# EAGLE design Astable 555 Timer (EAGLE 9.6.2)
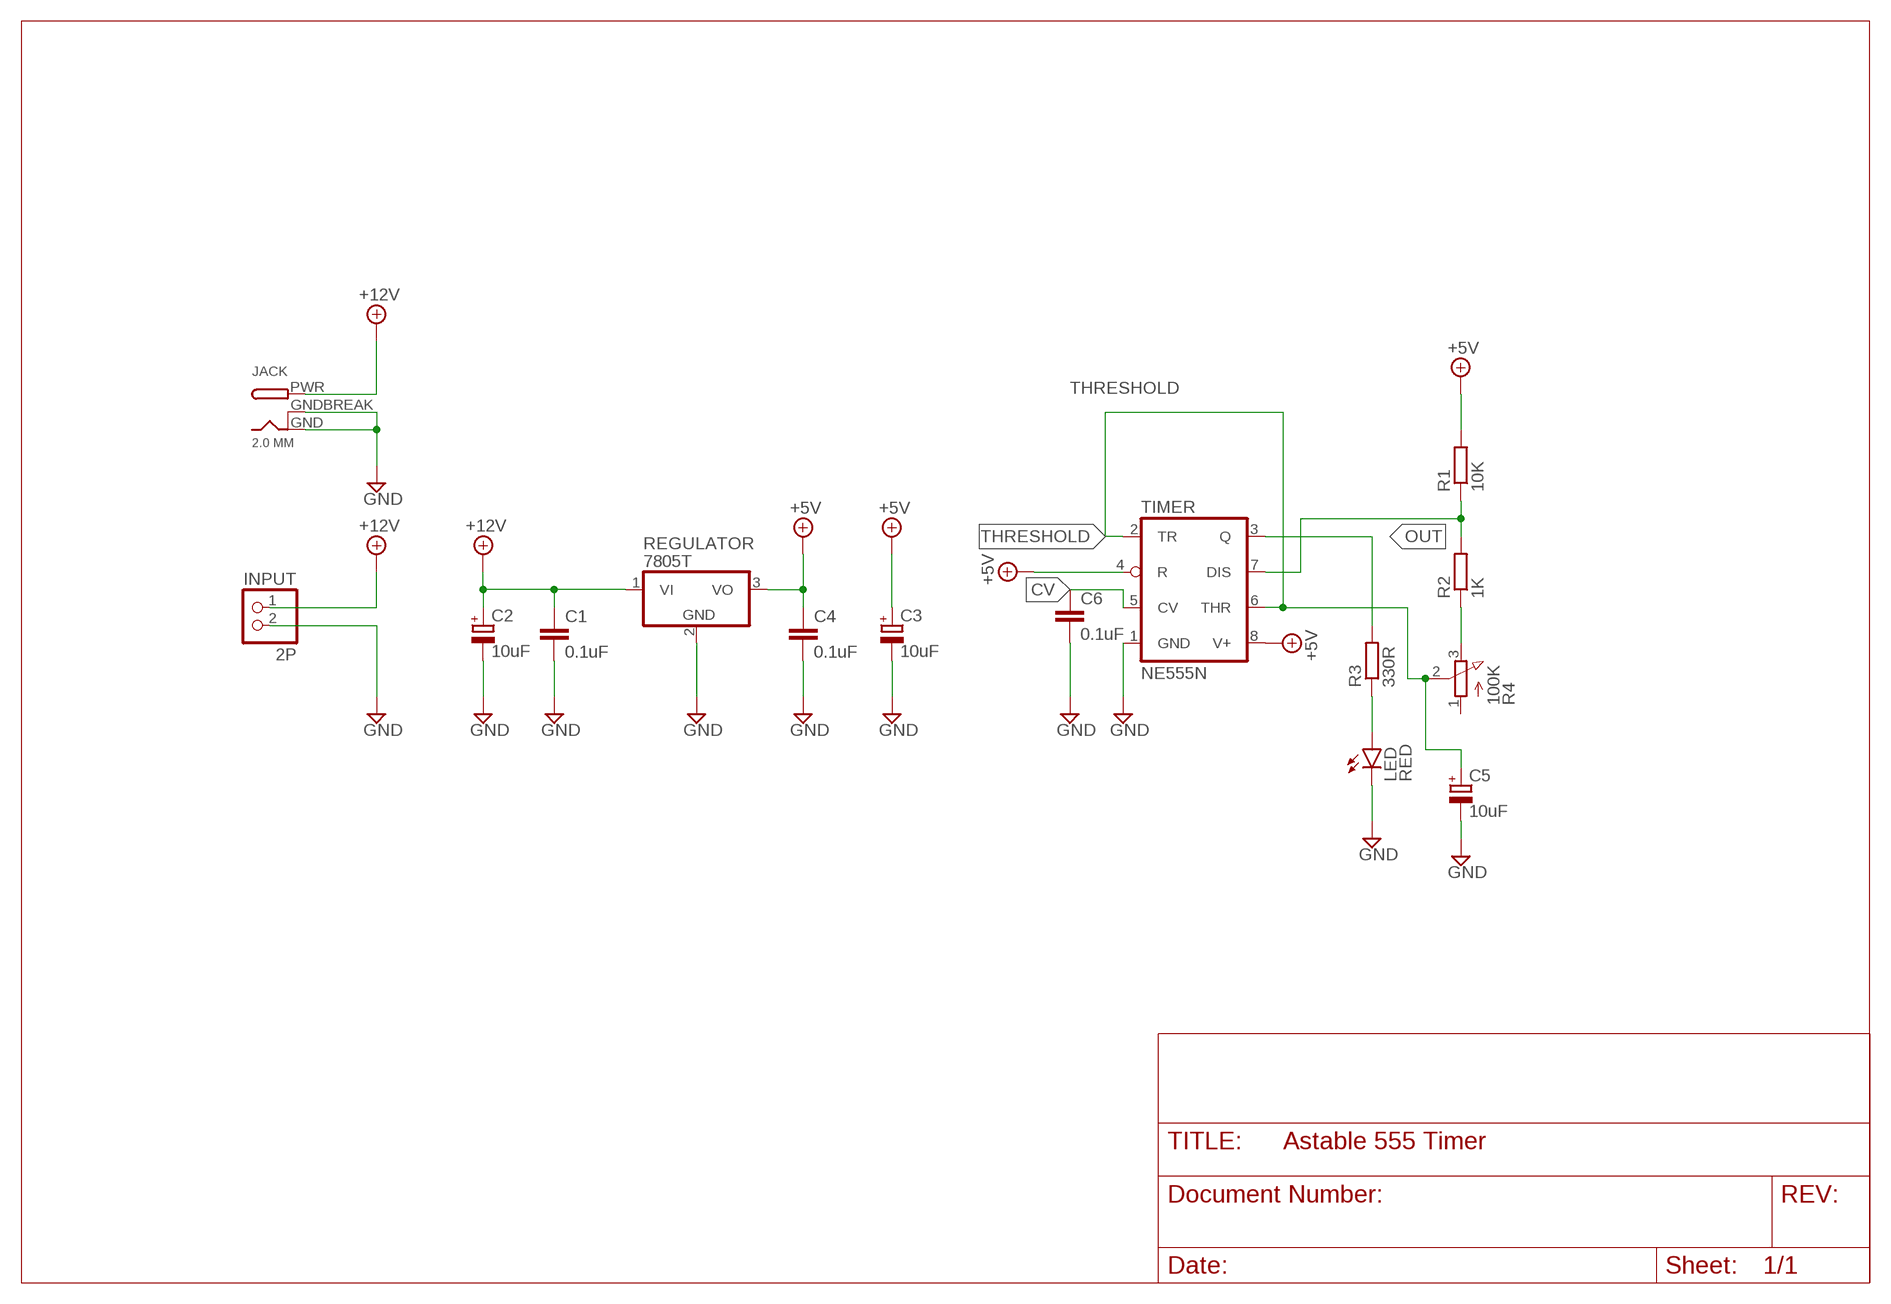
[diagram p0: schematic, sheet 1]

## Parts
C1  0.1uF  C-EU050-030X075  [C050-030X075]
C2  10uF  CPOL-EUE3.5-8  [E3,5-8]
C3  10uF  CPOL-EUE3.5-8  [E3,5-8]
C4  0.1uF  C-EU050-030X075  [C050-030X075]
C5  10uF  CPOL-EUE3.5-8  [E3,5-8]
C6  0.1uF  C-EU050-030X075  [C050-030X075]
INPUT  2P  PINHD-1X2  [1X02]
JACK  2.0 MM  DCBARRELPTH  [DCJACK_2MM_PTH]
LED  RED  LED5MM  [LED5MM]
R1  10K  R-EU_0207/10  [0207/10]
R2  1K  R-EU_0207/10  [0207/10]
R3  330R  R-EU_0207/10  [0207/10]
R4  100K  3RP/1610N  [3RP/1610N]
REGULATOR  7805T  [TO220H]
TIMER  NE555N  [DIL08]

## Nets
+5V: C3.+ C4.1 R1.2 REGULATOR.3(VO) TIMER.4(R) TIMER.8(V+)
+12V: C1.1 C2.+ INPUT.1 JACK.PWR REGULATOR.1(VI)
CV: C6.1 TIMER.5(CV)
GND: C1.2 C2.- C3.- C4.2 C5.- C6.2 INPUT.2 JACK.GND JACK.GNDBREAK LED.K(C) REGULATOR.2(GND) TIMER.1(GND)
N$2: R1.1 R2.2 TIMER.7(DIS)
N$4: R2.1 R4.3(E)
N$8: LED.A R3.1
OUT: R3.2 TIMER.3(Q)
THRESHOLD: C5.+ R4.2(S) TIMER.2(TR) TIMER.6(THR)
Unconnected: R4.1(A)

## Library data of the parts
C1 C4 C6 = rcl:C-EU: CAPACITOR, European symbol; SPICEPREFIX: C
C2 C3 C5 = rcl:CPOL-EU: POLARIZED CAPACITOR, European symbol; SPICEPREFIX: C
INPUT = pinhead:PINHD-1X2: PIN HEADER
JACK = adafruit:DCBARREL: 2.0mm DC Barrel Jack DCJACK_2MM_PTH - Through Hole Jack (4UConnector: 05537)
LED = led:LED: LED OSRAM: - CHIPLED LG R971, LG N971, LY N971, LG Q971, LY Q971, LO R971, LY R971 LH N974, LH R974 LS Q976, LO Q976, LY Q976 LO Q996 - Hyper CHIPLED LW Q18S LB Q993, LB Q99A, LB R99A - SideLED LS A670, LO A670, LY A670, LG A670, LP A670 LB A673, LV A673, LT A673, LW A673 LH A674 LY A675 LS A676, LA A676, LO A676, LY A676, LW A676 LS A679, LY A679, LG A679 - Hyper Micro SIDELED® LS Y876, LA Y876, LO Y876, LY Y876 LT Y87S - SmartLED LW L88C, LW L88S LB L89C, LB L89S, LG L890 LS L89K, LO L89K, LY L89K LS L896, LA L896, LO L896, LY L896 - TOPLED LS T670, LO T670, LY T670, LG T670, LP T670 LSG T670, LSP T670, LSY T670, LOP T670, LYG T670 LG T671, LOG T671, LSG T671 LB T673, LV T673, LT T673, LW T673 LH T674 LS T676, LA T676, LO T676, LY T676, LB T676, LH T676, LSB T676, LW T676 LB T67C, LV T67C, LT T67C, LS T67K, LO T67K, LY T67K, LW E67C LS E67B, LA E67B, LO E67B, LY E67B, LB E67C, LV E67C, LT E67C LW T67C LS T679, LY T679, LG T679 LS T770, LO T770, LY T770, LG T770, LP T770 LB T773, LV T773, LT T773, LW T773 LH T774 LS E675, LA E675, LY E675, LS T675 LS T776, LA T776, LO T776, LY T776, LB T776 LHGB T686 LT T68C, LB T68C - Hyper Mini TOPLED® LB M676 - Mini TOPLED Santana® LG M470 LS M47K, LO M47K, LY M47K Source: http://www.osram.convergy.de LUXEON: - LUMILED® LXK2-PW12-R00, LXK2-PW12-S00, LXK2-PW14-U00, LXK2-PW14-V00 LXK2-PM12-R00, LXK2-PM12-S00, LXK2-PM14-U00 LXK2-PE12-Q00, LXK2-PE12-R00, LXK2-PE12-S00, LXK2-PE14-T00, LXK2-PE14-U00 LXK2-PB12-K00, LXK2-PB12-L00, LXK2-PB12-M00, LXK2-PB14-N00, LXK2-PB14-P00, LXK2-PB14-Q00 LXK2-PR12-L00, LXK2-PR12-M00, LXK2-PR14-Q00, LXK2-PR14-R00 LXK2-PD12-Q00, LXK2-PD12-R00, LXK2-PD12-S00 LXK2-PH12-R00, LXK2-PH12-S00 LXK2-PL12-P00, LXK2-PL12-Q00, LXK2-PL12-R00 Source: www.luxeon.com KINGBRIGHT: KA-3528ASYC Source: www.kingbright.com
R1-R3 = rcl:R-EU_: RESISTOR, European symbol; SPICEPREFIX: R
R4 = pot:3RP/1610N: 16mm Potentiometer one level Source: http://www.alphapotentiometers.net/html/16mm_pot_2.html
REGULATOR = linear:78*: Positive VOLTAGE REGULATOR Source: http://cache.national.com/ds/LM/LM78L05.pdf http://www.fairchildsemi.com/ds/LM/LM7805.pdf
TIMER = linear:*555: TIMER

## Board
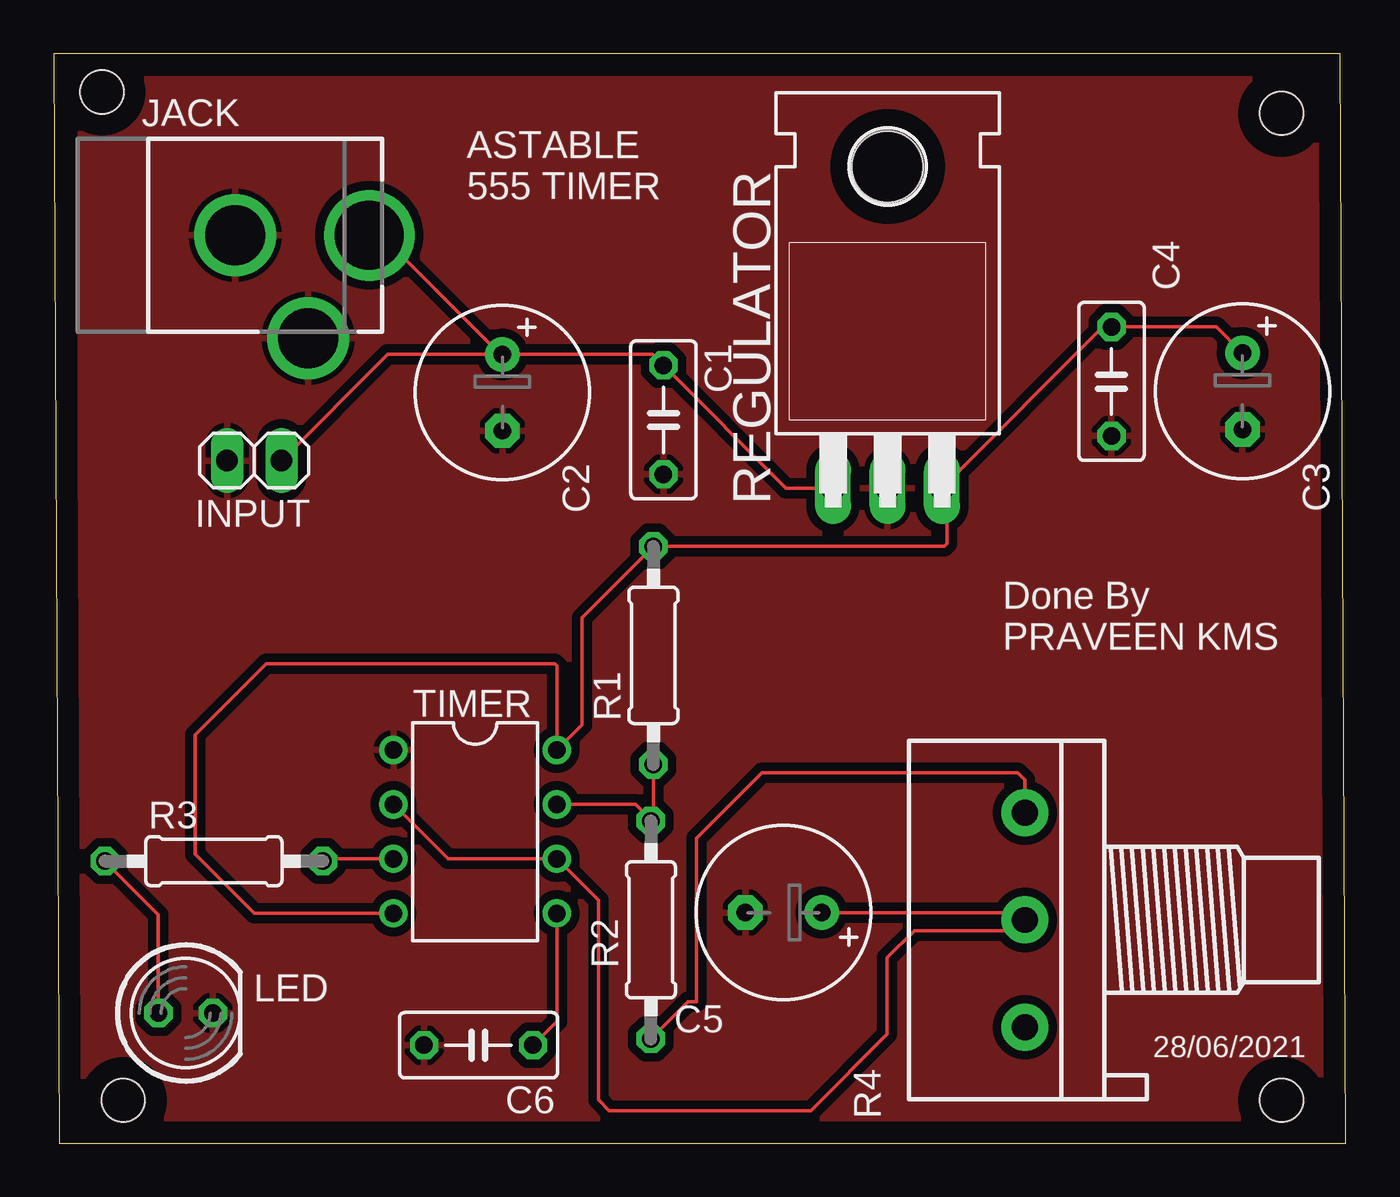
[diagram p1: board, top side]

Size 60.25 x 50.79 mm. Coordinates in mm from the lower left corner, seen from the top.
Outline: 0.25,0 60.25,0 60,50.79 0,50.79 0.25,0
Copper layers (1*16): Top 0.035mm / dielectric 1.5mm / Bottom 0.035mm
Design rules "default": minimum track width 6mil, minimum drill 0.35mm, track to track 6mil, track to pad 6mil, pad to pad 6mil, via to via 6mil, smd to smd 6mil, copper to edge 40mil, drill to drill 6mil, minimum pad ring 10mil, minimum via ring 8mil, stop-mask expansion 4mil, vias tented up to drill 0mil, thermal gap 10mil
Holes 2 mm at 2.25,49 57.25,48 3.25,2 57.25,2

### Footprints (pad centres in the part's own frame; a part is rotated, then mirrored left to right if it is on the bottom)
C050-030X075 = drill 0.813 octagon: 1 -2.54,0; 2 2.54,0
E3,5-8 = drill 0.813 pad 1.6: + -1.778,0 | drill 0.813 pad 1.6 octagon: - 1.778,0
1X02 = drill 1.016 long: 1 -1.27,0; 2 1.27,0
DCJACK_2MM_PTH = drill 2.8: GND 0,7.35; GNDBREAK 4.8,10.75 | drill 3.2: PWR 0,13.6
LED5MM = drill 0.813 octagon: A -1.27,0; K 1.27,0
0207/10 = drill 0.813 octagon: 1 -5.08,0; 2 5.08,0
3RP/1610N = drill 1.2 pad 2.184: 1 -5,0; 2 0,0; 3 5,0
TO220H = drill 1.118 long: 1 -2.54,-10.16; 2 0,-10.16; 3 2.54,-10.16 | hole 3.302: 0,4.826
DIL08 = drill 0.813 pad 1.27: 1 -3.81,-3.81; 2 -1.27,-3.81; 3 1.27,-3.81; 4 3.81,-3.81; 5 3.81,3.81; 6 1.27,3.81; 7 -1.27,3.81; 8 -3.81,3.81

### Placement (x,y rotation side)
C1  28.43,33.72 270 top
C2  20.92,34.99 270 top
C3  55.43,35.05 270 top
C4  49.32,35.51 270 top
C5  34.03,10.75 180 top
C6  19.81,4.57 180 top
INPUT  9.35,31.82 180 top
JACK  1.11,42.32 270 top
LED  6.15,6.07 0 top
R1  27.96,22.74 90 top
R2  27.85,9.95 90 top
R3  7.47,13.15 0 top
R4  45.28,10.41 90 top
REGULATOR  38.88,40.7 0 top
TIMER  19.65,14.53 270 top

### Tracks (layer width: path | path; a pad name or v marks a point on that pad's centre or on a via)
+5V
  Top 0.152: REGULATOR.3 41.51,30.63 | 41.51,30.63 48.93,38.05 C4.1 54.21,38.05 C3.+ | TIMER.4 9.35,10.72 6.6,13.46 6.6,19.05 9.91,22.35 23.37,22.35 23.46,22.26 TIMER.8 24.64,19.51 24.64,24.5 R1.2 41.54,27.82 41.66,27.94 41.66,30.48 41.51,30.63
+12V
  Top 0.152: INPUT.1 15.57,36.77 20.83,36.77 | 20.83,36.77 C2.+ 27.93,36.77 28.28,36.41 C1.1 34.15,30.54 REGULATOR.1 | JACK.PWR 15.28,42.32 20.83,36.77
CV
  Top 0.152: C6.1 23.46,5.68 TIMER.5
GND
  pour Top (isolate 0.406): 0.25,50 58.25,50 59.25,49 59.25,1 1.25,1 1.25,49
N$2
  Top 0.152: R1.1 27.96,15.14 27.87,15.05 | 27.87,15.05 R2.2 | TIMER.7 27.13,15.8 27.87,15.05
N$4
  Top 0.152: R2.1 29.58,6.6 29.97,6.6 29.97,14.22 33.02,17.27 44.96,17.27 45.28,16.95 R4.3
N$8
  Top 0.152: LED.A 4.88,10.66 R3.1
OUT
  Top 0.152: R3.2 12.66,13.26 TIMER.3
THRESHOLD
  Top 0.152: C5.+ 44.94,10.75 R4.2 45.47,10.23 45.47,9.91 40.13,9.91 38.86,8.64 38.86,5.08 35.31,1.52 25.91,1.52 25.4,2.03 25.4,11.32 TIMER.6 18.38,13.26 TIMER.2

### Text on the board
tPlace: ASTABLE / 555 TIMER | Done By / PRAVEEN KMS | 28/06/2021